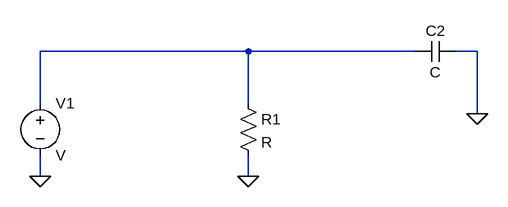
[diagram p0: schematic SimpleHP.asc]
SimpleHP.asc, the LTspice schematic file:
Version 4
SHEET 1 880 680
WIRE 320 144 0 144
WIRE 576 144 320 144
WIRE 672 144 640 144
WIRE 0 224 0 144
WIRE 320 224 320 144
WIRE 672 240 672 144
WIRE 0 336 0 304
WIRE 320 336 320 304
FLAG 320 336 0
FLAG 672 240 0
FLAG 0 336 0
SYMBOL res 304 208 R0
SYMATTR InstName R1
SYMBOL Cap 640 128 R90
WINDOW 0 0 32 VBottom 2
WINDOW 3 32 32 VTop 2
SYMATTR InstName C2
SYMBOL Voltage 0 208 R0
SYMATTR InstName V1

The netlist it stands for:
* SimpleHP.asc
R1 N001 0 R
C2 0 N001 C
V1 N001 0 V
.backanno
.end